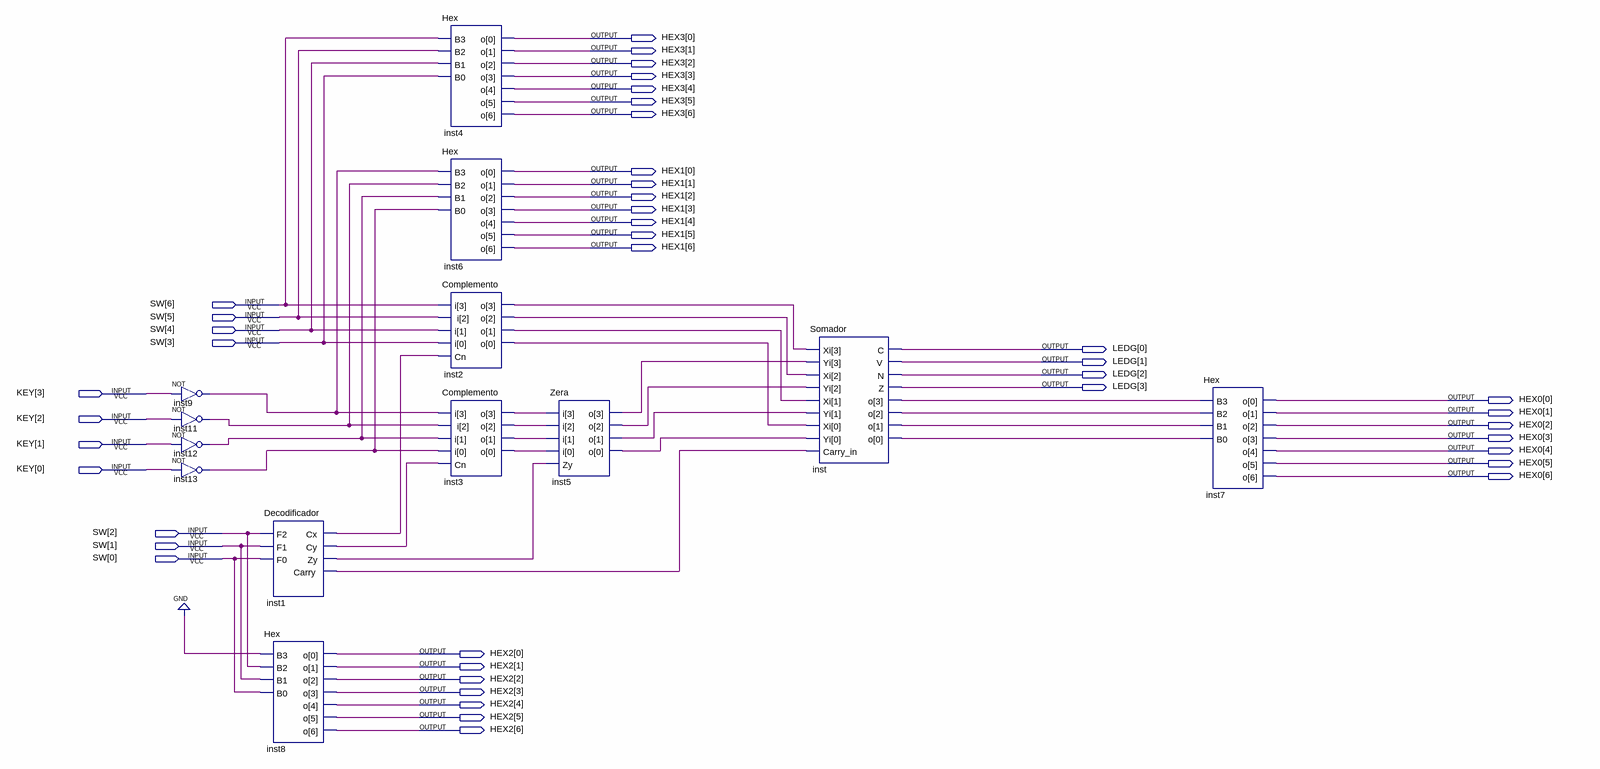
[diagram p0: schematic sheet]
// Quartus schematic ULAH.bdf as structural Verilog: 13 symbols, 43 pins
module ULAH (
  input  [6:0] SW,
  input  [3:0] KEY,
  output [6:0] HEX3,
  output [6:0] HEX1,
  output [3:0] LEDG,
  output [6:0] HEX0,
  output [6:0] HEX2
);

  wire inst1_carry, inst1_cx, inst1_cy, inst1_zy, inst2_o, inst2_o_2, inst2_o_3, inst2_o_4, inst3_o,
       inst3_o_2, inst3_o_3, inst3_o_4, inst5_o, inst5_o_2, inst5_o_3, inst5_o_4, inst9_out, inst11_out,
       inst12_out, inst13_out, inst_o, inst_o_2, inst_o_3, inst_o_4;

  not inst9 (inst9_out, KEY[3]);
  not inst11 (inst11_out, KEY[2]);
  not inst12 (inst12_out, KEY[1]);
  not inst13 (inst13_out, KEY[0]);
  Decodificador inst1 (
    .F2(SW[2]), .F1(SW[1]), .F0(SW[0]), .Cx(inst1_cx), .Cy(inst1_cy), .Zy(inst1_zy), .Carry(inst1_carry));
  Hex inst8 (.B3(1'b0), .B2(SW[2]), .B1(SW[1]), .B0(SW[0]), .o(HEX2));
  Hex inst4 (.B3(SW[6]), .B2(SW[5]), .B1(SW[4]), .B0(SW[3]), .o(HEX3));
  Hex inst6 (.B3(inst9_out), .B2(inst11_out), .B1(inst12_out), .B0(inst13_out), .o(HEX1));
  Complemento inst2 (.i(SW[6:3]), .Cn(inst1_cx), .o({inst2_o, inst2_o_2, inst2_o_3, inst2_o_4}));
  Complemento inst3 (
    .i({inst9_out, inst11_out, inst12_out, inst13_out}), .Cn(inst1_cy),
    .o({inst3_o, inst3_o_2, inst3_o_3, inst3_o_4}));
  Zera inst5 (
    .i({inst3_o, inst3_o_2, inst3_o_3, inst3_o_4}), .Zy(inst1_zy),
    .o({inst5_o_4, inst5_o_3, inst5_o_2, inst5_o}));
  Somador inst (
    .Xi({inst2_o, inst2_o_2, inst2_o_3, inst2_o_4}), .Yi({inst5_o_4, inst5_o_3, inst5_o_2, inst5_o}),
    .Carry_in(inst1_carry), .C(LEDG[0]), .V(LEDG[1]), .N(LEDG[2]), .Z(LEDG[3]),
    .o({inst_o, inst_o_2, inst_o_3, inst_o_4}));
  Hex inst7 (.B3(inst_o), .B2(inst_o_2), .B1(inst_o_3), .B0(inst_o_4), .o(HEX0));
endmodule
